# EAGLE schematic FanController (EAGLE 9.6.2)
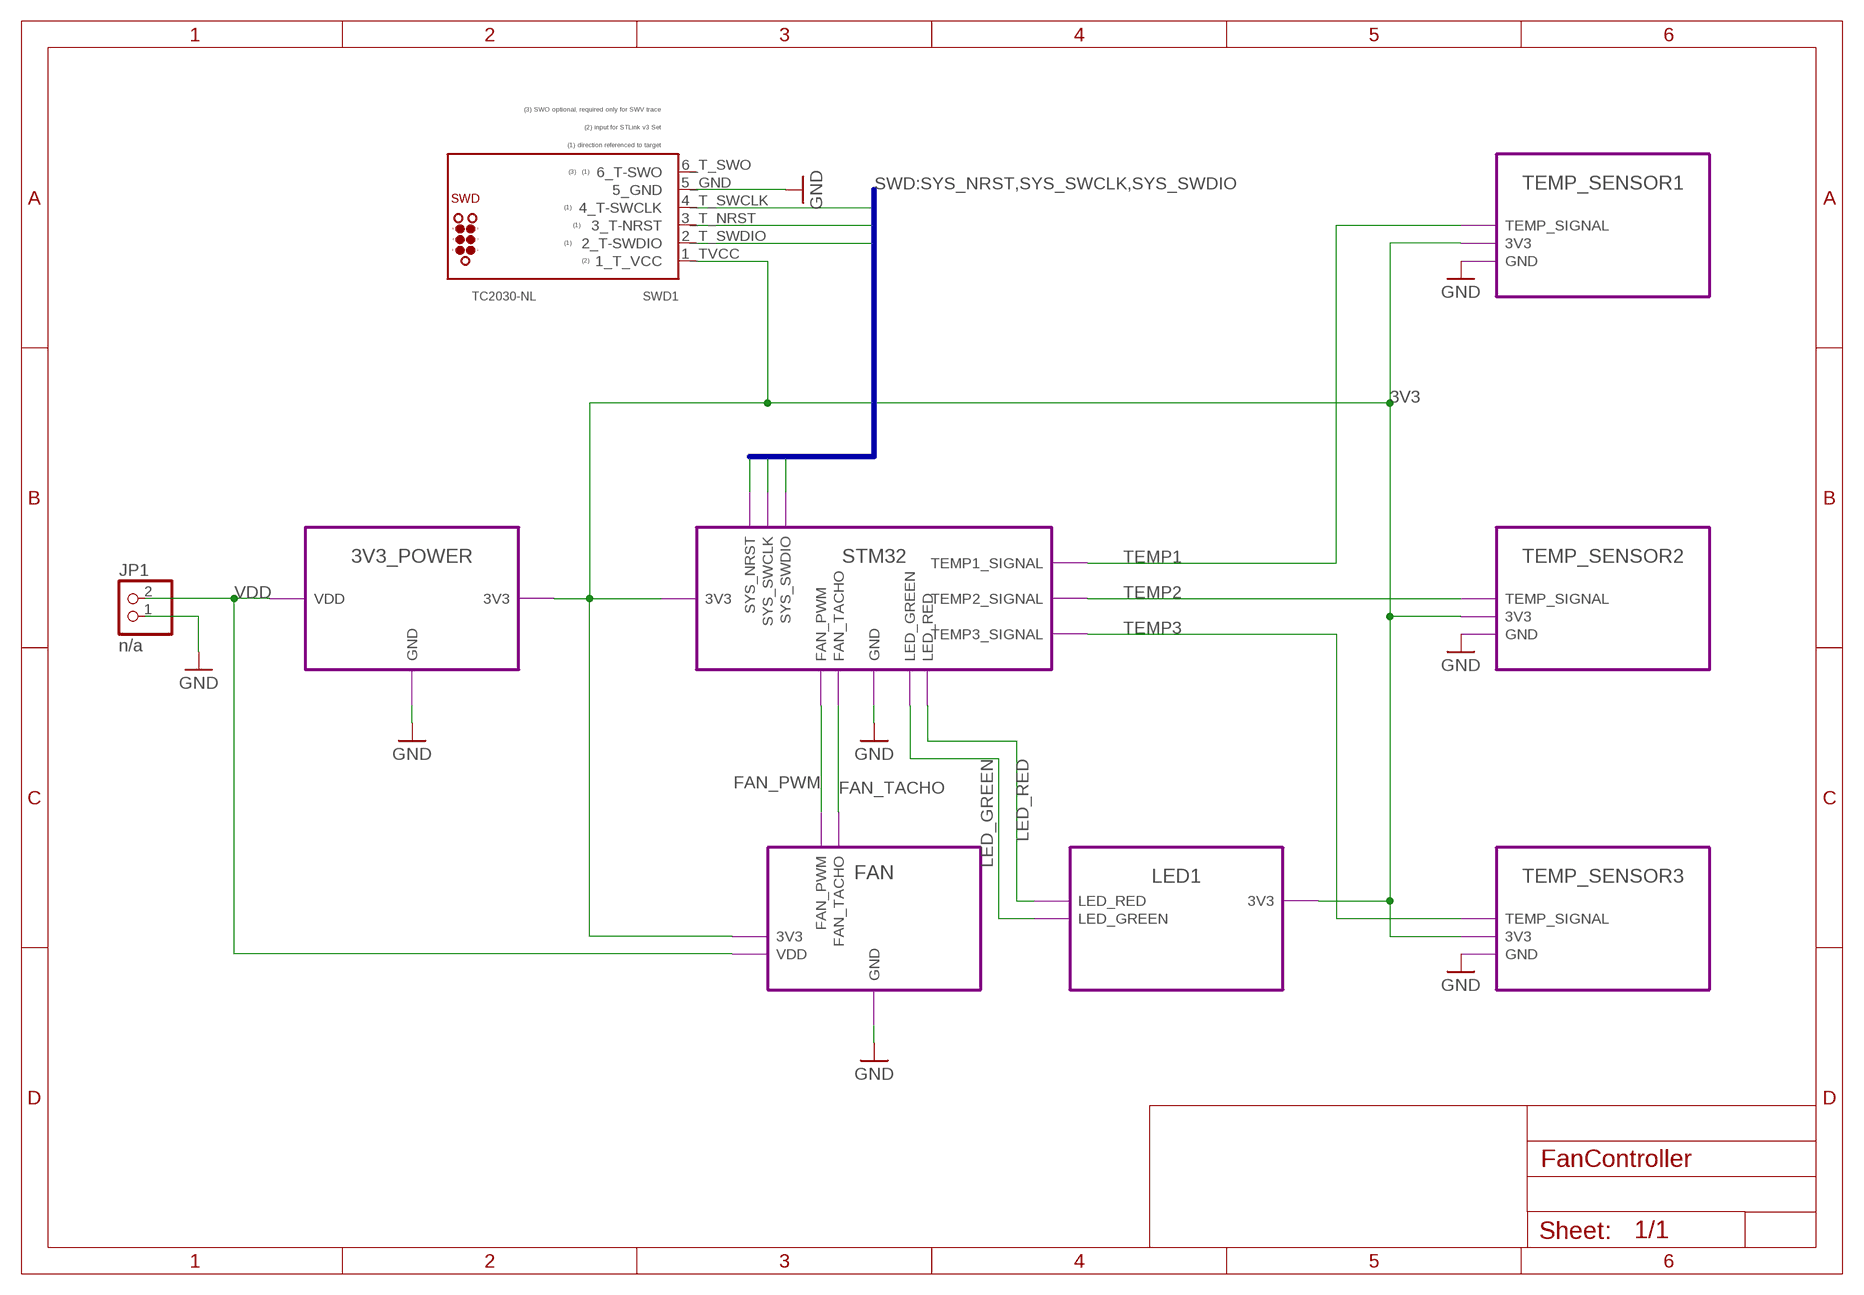
[diagram p0: schematic, sheet 1]

## Parts
JP1  n/a  PINHD-1X2  [1X02]
SWD1  TC2030-NL  TC2030  [TC2030-NL]

## Module instances
3V3_POWER = 3V3_POWER (part numbers offset by 100)
STM32 = STM32 (part numbers offset by 200)
TEMP_SENSOR1 = TEMP_SENSOR (part numbers offset by 400)
FAN = FAN (part numbers offset by 300)
TEMP_SENSOR2 = TEMP_SENSOR (part numbers offset by 500)
TEMP_SENSOR3 = TEMP_SENSOR (part numbers offset by 600)
LED1 = LED (part numbers offset by 700)

## Nets
3V3 [3V3]: SWD1.1_TVCC(1_T_VCC) ; port TEMP_SENSOR1.3V3 TEMP_SENSOR3.3V3 TEMP_SENSOR2.3V3 3V3_POWER.3V3 STM32.3V3 LED1.3V3 FAN.3V3
FAN_PWM [signal]: port STM32.FAN_PWM FAN.FAN_PWM
FAN_TACHO [signal]: port FAN.FAN_TACHO STM32.FAN_TACHO
GND: JP1.1 SWD1.5_GND ; port FAN.GND STM32.GND 3V3_POWER.GND TEMP_SENSOR1.GND TEMP_SENSOR2.GND TEMP_SENSOR3.GND
LED_GREEN: port STM32.LED_GREEN LED1.LED_GREEN
LED_RED: port STM32.LED_RED LED1.LED_RED
SYS_NRST [signal]: SWD1.3_T_NRST(3_T-NRST) ; port STM32.SYS_NRST
SYS_SWCLK [signal]: SWD1.4_T_SWCLK(4_T-SWCLK) ; port STM32.SYS_SWCLK
SYS_SWDIO [signal]: SWD1.2_T_SWDIO(2_T-SWDIO) ; port STM32.SYS_SWDIO
TEMP1 [signal]: port STM32.TEMP1_SIGNAL TEMP_SENSOR1.TEMP_SIGNAL
TEMP2 [signal]: port STM32.TEMP2_SIGNAL TEMP_SENSOR2.TEMP_SIGNAL
TEMP3 [signal]: port STM32.TEMP3_SIGNAL TEMP_SENSOR3.TEMP_SIGNAL
VDD [3V3]: JP1.2 ; port 3V3_POWER.VDD FAN.VDD
Unconnected: SWD1.6_T_SWO(6_T-SWO)

## Buses
SWD:SYS_NRST,SYS_SWCLK,SYS_SWDIO

## Library data of the parts
JP1 = pinhead:PINHD-1X2: PIN HEADER
SWD1 = tag-connect:TC2030: TC2030 pad no. Function STLink v3 CN1 pin no. Function 1 Reserved (1) 2 Reserved (1) 1 T_Vcc 3 T_Vcc (2) 2 T_SWDIO 4 T_JTMS/T_SWDIO 5 GND 4 T_SWCLK 6 T_JCLK / T_SWCLK 5 GND 7 GND 6 8 T_JTDO / T_SWO (3) 9 T_JRCLK (4) / NC (5) 10 T_JTDI / NC (5) 11 GNDDetect (6) 3 T_NRST 12 T_NRST 13 T_VCP_RX (7) 14 T_VCP_TX (2) (1) Do not connect to the target (2) Input for STLINK-V3SET (3) SWO is optional, required only for Serial Wire Viewer (SWV) trace (4) Optional loopback of T_JCLK on the target side, required if loopback is removed on the STLINK-V3SET side (5) NC means not required for the SWD connection (6) Tied to GND by STLINK-V3SET firmware; may be used by the target for detection of the tool (7) Output for STLINK-V3SET

## Module 3V3_POWER
Ports: GND(pwr) VDD(pwr) 3V3(pwr)
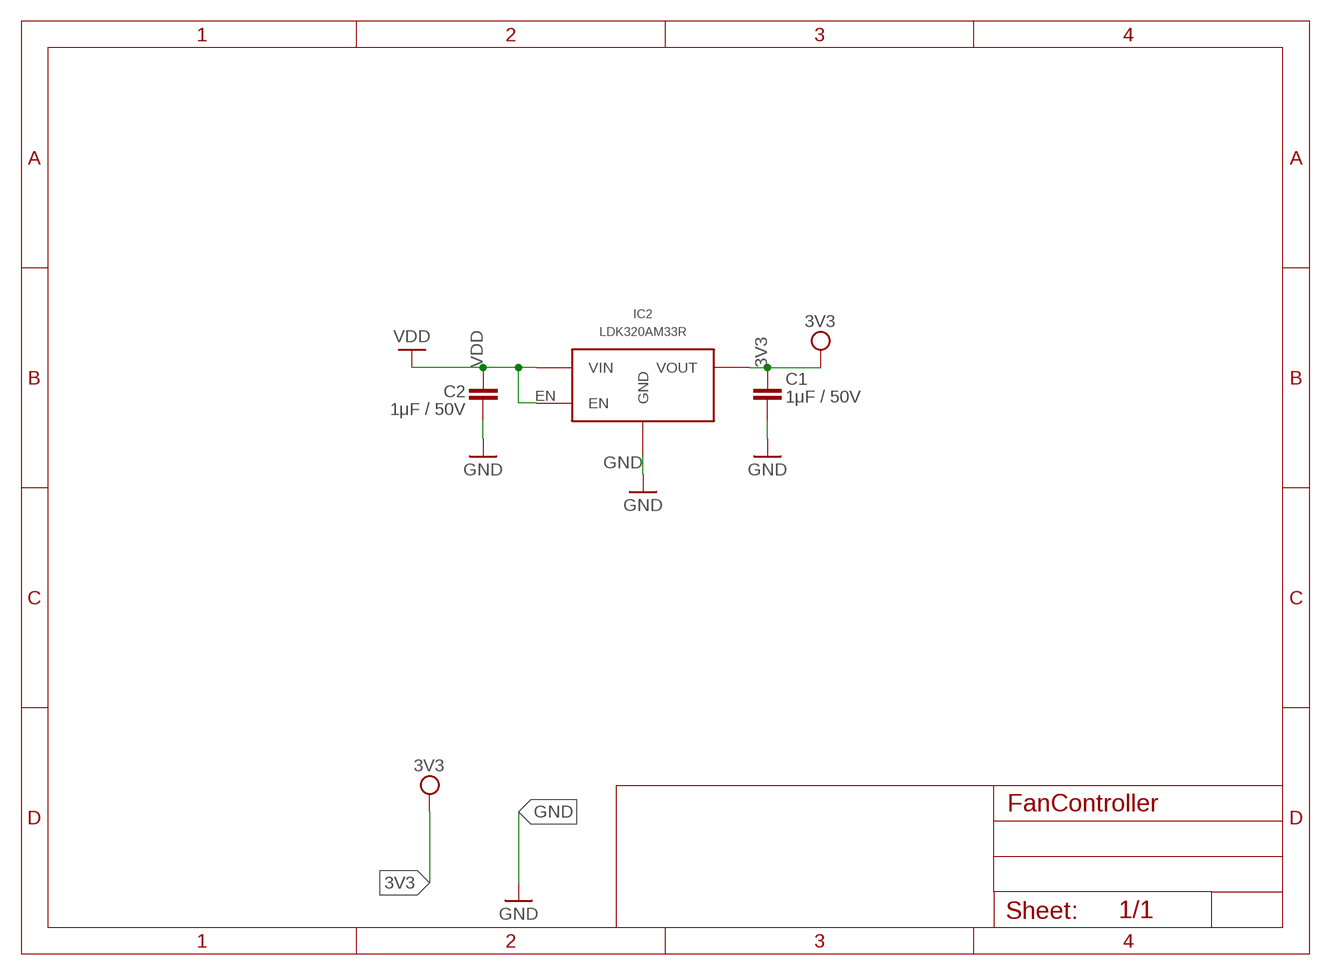
[diagram p1: schematic, module 3V3_POWER, sheet 1]

### Parts
C1  1μF / 50V  C-EUC0805  [C0805]
C2  1μF / 50V  C-EUC0805  [C0805]
IC2  LDK320AM33R  LDK320SOT-23-5L  [SOT-23-5L]

### Nets
3V3: C1.1 IC2.OUT(VOUT)
GND: C1.2 C2.2 IC2.GND
VDD: C2.1 IC2.EN IC2.IN(VIN)

### Library data of the parts
C1 C2 = rcl:C-EU: CAPACITOR, European symbol; SPICEPREFIX: C
IC2 = LDK320 5V LDO:LDK320

## Module STM32
Ports: GND(pwr) 3V3(pwr) FAN_PWM(out) TEMP1_SIGNAL(in) TEMP2_SIGNAL(in) TEMP3_SIGNAL(in) SYS_NRST(in) SYS_SWCLK(io) SYS_SWDIO(io) FAN_TACHO(in) LED_GREEN(in) LED_RED(in)
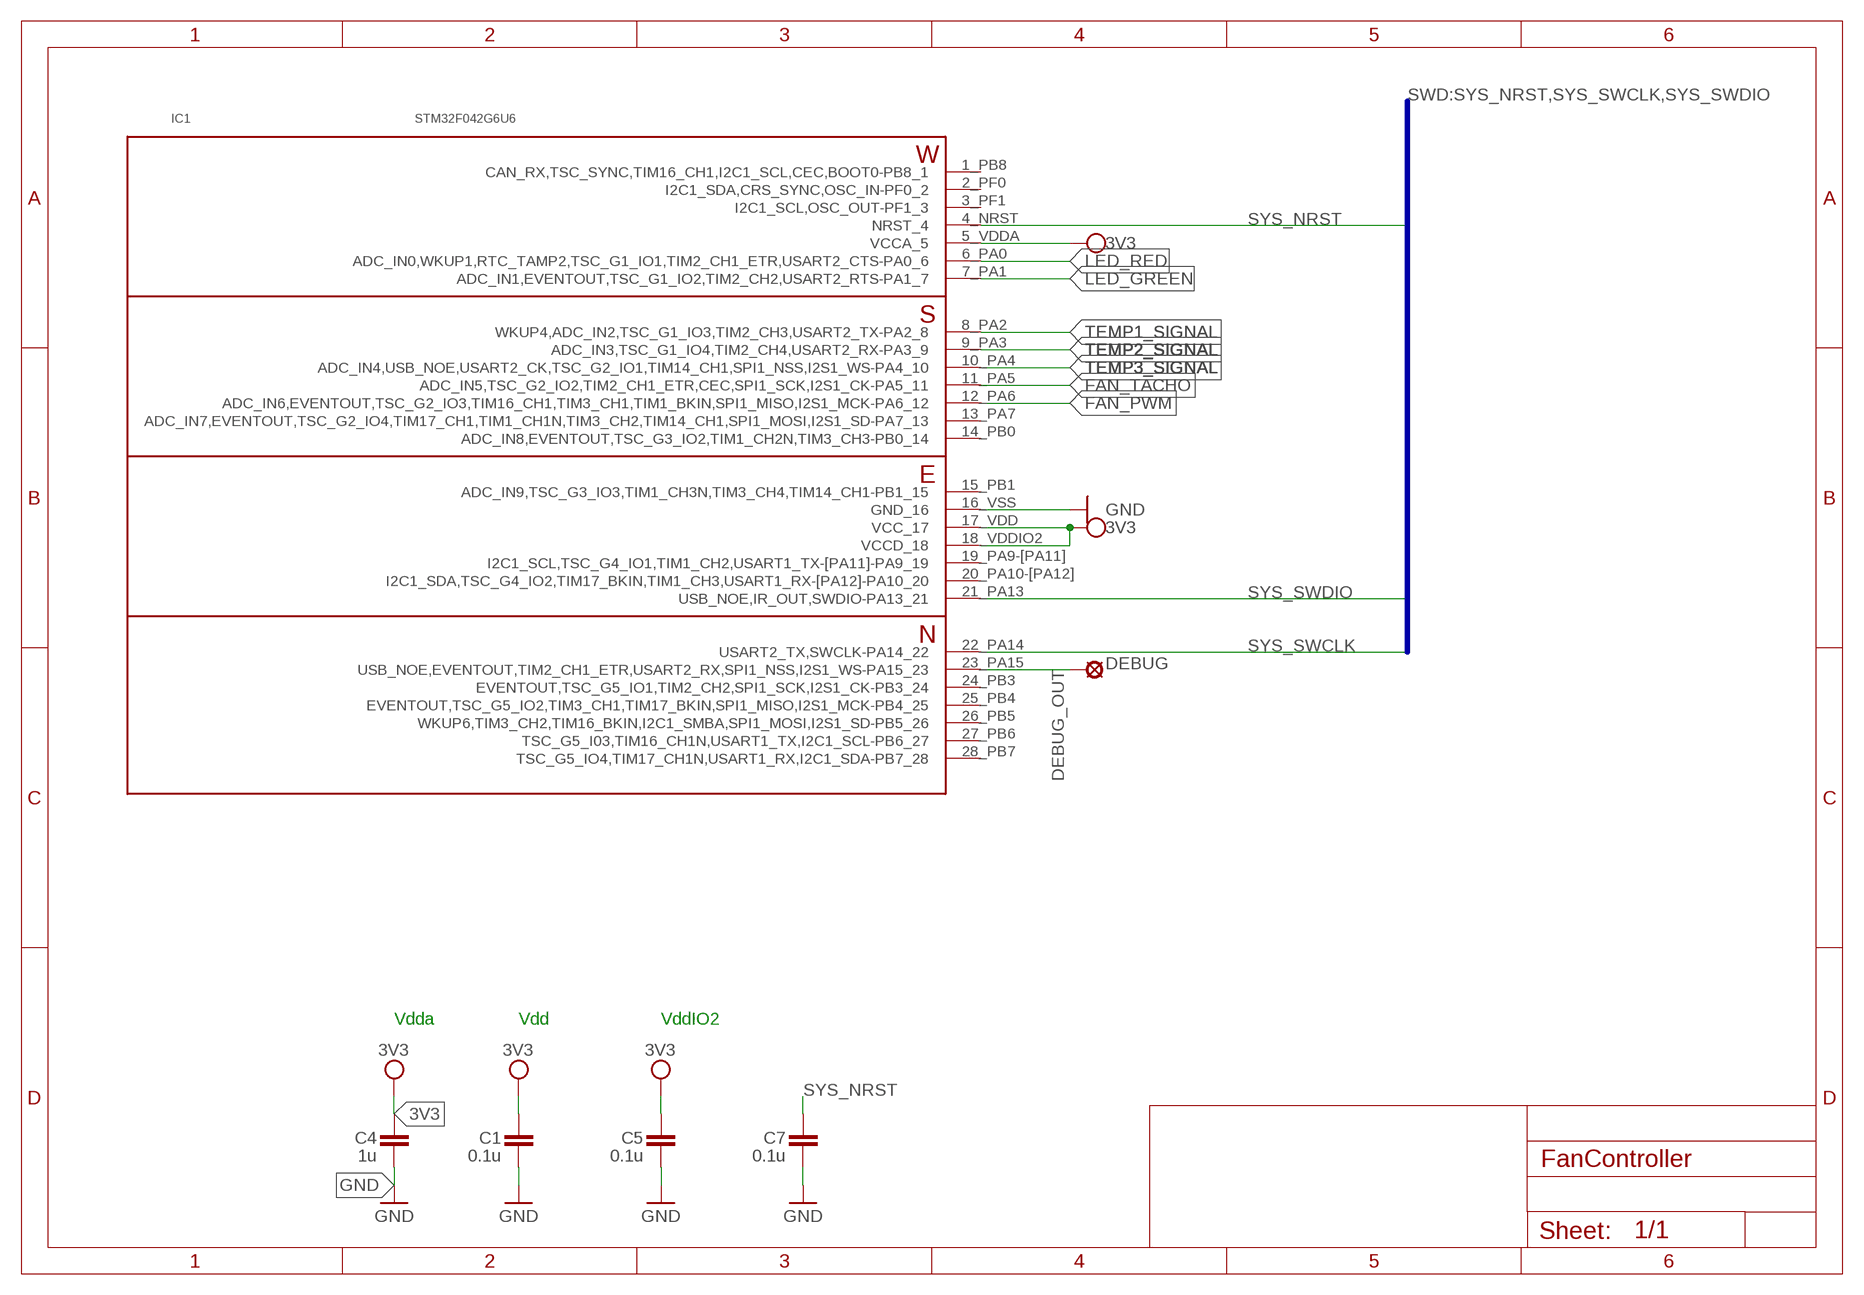
[diagram p2: schematic, module STM32, sheet 1]

### Parts
C1  0.1u  C-EUC0805  [C0805]
C4  1u  C-EUC0805  [C0805]
C5  0.1u  C-EUC0805  [C0805]
C7  0.1u  C-EUC0805  [C0805]
DEBUG  LSP10  [LSP10]
IC1  STM32F042G6U6  STM32F042G6  [UFQFPN-28]

### Nets
3V3: C1.2 C4.2 C5.2 IC1.5_VDDA(VCCA_5) IC1.17_VDD(VCC_17) IC1.18_VDDIO2(VCCD_18)
DEBUG_OUT: DEBUG.MP IC1.23_PA15(USB_NOE,EVENTOUT,TIM2_CH1_ETR,USART2_RX,SPI1_NSS,I2S1_WS-PA15_23)
FAN_PWM: IC1.12_PA6(ADC_IN6,EVENTOUT,TSC_G2_IO3,TIM16_CH1,TIM3_CH1,TIM1_BKIN,SPI1_MISO,I2S1_MCK-PA6_12)
FAN_TACHO: IC1.11_PA5(ADC_IN5,TSC_G2_IO2,TIM2_CH1_ETR,CEC,SPI1_SCK,I2S1_CK-PA5_11)
GND: C1.1 C4.1 C5.1 C7.1 IC1.16_VSS(GND_16)
LED_GREEN [3V3]: IC1.7_PA1(ADC_IN1,EVENTOUT,TSC_G1_IO2,TIM2_CH2,USART2_RTS-PA1_7)
LED_RED [3V3]: IC1.6_PA0(ADC_IN0,WKUP1,RTC_TAMP2,TSC_G1_IO1,TIM2_CH1_ETR,USART2_CTS-PA0_6)
SYS_NRST: C7.2 IC1.4_NRST(NRST_4)
SYS_SWCLK: IC1.22_PA14(USART2_TX,SWCLK-PA14_22)
SYS_SWDIO: IC1.21_PA13(USB_NOE,IR_OUT,SWDIO-PA13_21)
TEMP1_SIGNAL: IC1.8_PA2(WKUP4,ADC_IN2,TSC_G1_IO3,TIM2_CH3,USART2_TX-PA2_8)
TEMP2_SIGNAL: IC1.9_PA3(ADC_IN3,TSC_G1_IO4,TIM2_CH4,USART2_RX-PA3_9)
TEMP3_SIGNAL: IC1.10_PA4(ADC_IN4,USB_NOE,USART2_CK,TSC_G2_IO1,TIM14_CH1,SPI1_NSS,I2S1_WS-PA4_10)
Unconnected: IC1.1_PB8(CAN_RX,TSC_SYNC,TIM16_CH1,I2C1_SCL,CEC,BOOT0-PB8_1) IC1.2_PF0(I2C1_SDA,CRS_SYNC,OSC_IN-PF0_2) IC1.3_PF1(I2C1_SCL,OSC_OUT-PF1_3) IC1.13_PA7(ADC_IN7,EVENTOUT,TSC_G2_IO4,TIM17_CH1,TIM1_CH1N,TIM3_CH2,TIM14_CH1,SPI1_MOSI,I2S1_SD-PA7_13) IC1.14_PB0(ADC_IN8,EVENTOUT,TSC_G3_IO2,TIM1_CH2N,TIM3_CH3-PB0_14) IC1.15_PB1(ADC_IN9,TSC_G3_IO3,TIM1_CH3N,TIM3_CH4,TIM14_CH1-PB1_15) IC1.19_PA9-[PA11](I2C1_SCL,TSC_G4_IO1,TIM1_CH2,USART1_TX-[PA11]-PA9_19) IC1.20_PA10-[PA12](I2C1_SDA,TSC_G4_IO2,TIM17_BKIN,TIM1_CH3,USART1_RX-[PA12]-PA10_20) IC1.24_PB3(EVENTOUT,TSC_G5_IO1,TIM2_CH2,SPI1_SCK,I2S1_CK-PB3_24) IC1.25_PB4(EVENTOUT,TSC_G5_IO2,TIM3_CH1,TIM17_BKIN,SPI1_MISO,I2S1_MCK-PB4_25) IC1.26_PB5(WKUP6,TIM3_CH2,TIM16_BKIN,I2C1_SMBA,SPI1_MOSI,I2S1_SD-PB5_26) IC1.27_PB6(TSC_G5_I03,TIM16_CH1N,USART1_TX,I2C1_SCL-PB6_27) IC1.28_PB7(TSC_G5_IO4,TIM17_CH1N,USART1_RX,I2C1_SDA-PB7_28)

### Buses
SWD:SYS_NRST,SYS_SWCLK,SYS_SWDIO

### Notes on the sheet
- Vdda | Vdd | VddIO2

### Library data of the parts
C1 C4 C5 C7 = rcl:C-EU: CAPACITOR, European symbol; SPICEPREFIX: C
DEBUG = solpad:LSP10: SOLDER PAD drill 1.0 mm, distributor Buerklin, 12H555
IC1 = STM32F042G6:STM32F042G6

## Module TEMP_SENSOR
Ports: GND(pwr) 3V3(pwr) TEMP_SIGNAL(out)
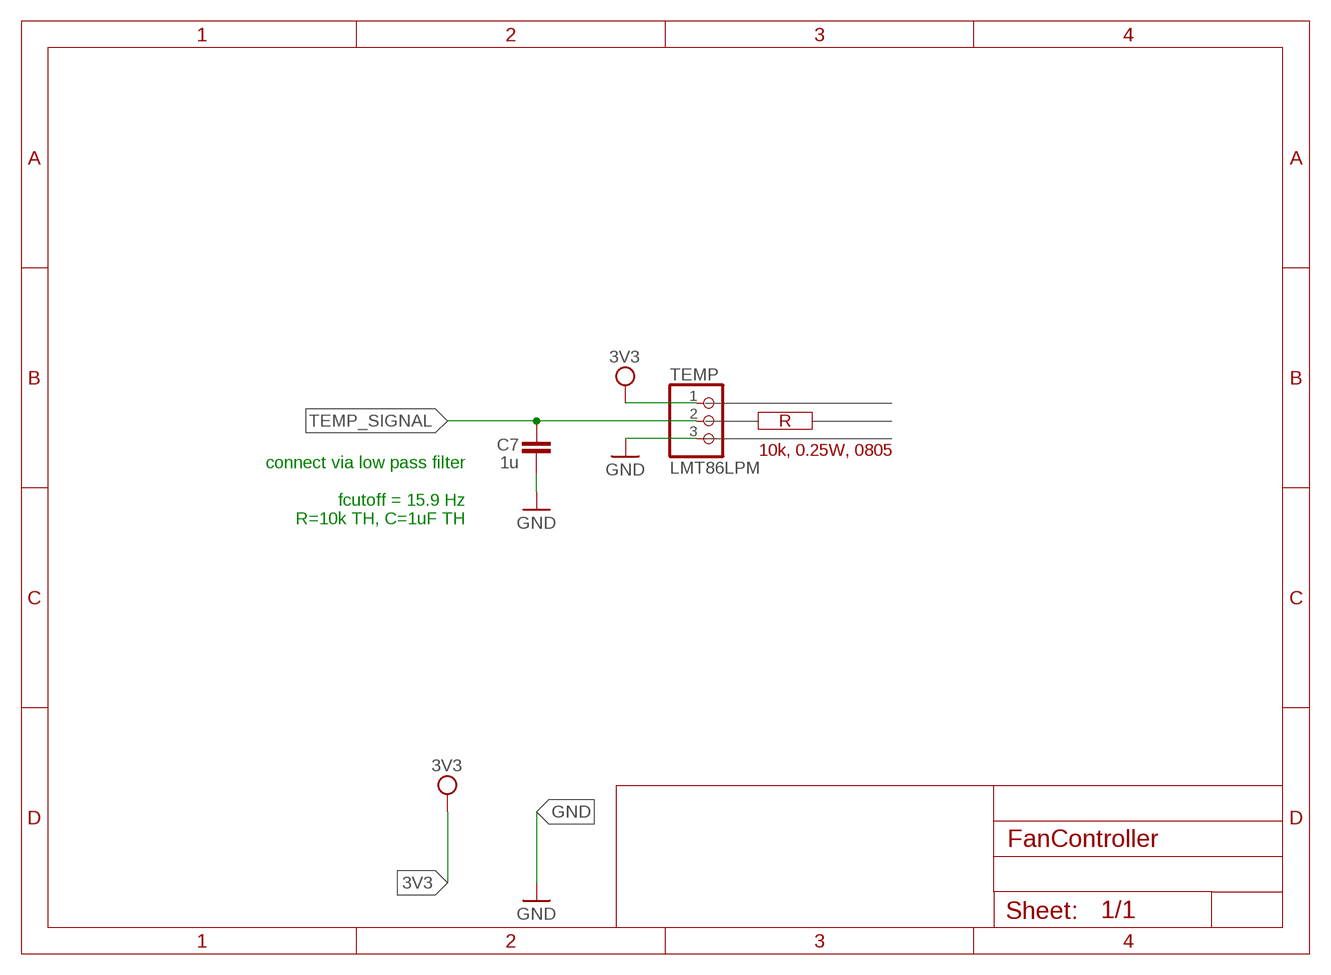
[diagram p3: schematic, module TEMP_SENSOR, sheet 1]

### Parts
C7  1u  C-EUC0805  [C0805]
TEMP  LMT86LPM  PINHD-1X3  [1X03]

### Nets
3V3: TEMP.1
GND: C7.1 TEMP.3
TEMP_SIGNAL: C7.2 TEMP.2

### Notes on the sheet
- R
- connect via low pass filter
  
  fcutoff = 15.9 Hz
  R=10k TH, C=1uF TH
- 10k, 0.25W, 0805

### Library data of the parts
C7 = rcl:C-EU: CAPACITOR, European symbol; SPICEPREFIX: C
TEMP = pinhead:PINHD-1X3: PIN HEADER

## Module FAN
Ports: GND(pwr) FAN_PWM(in) VDD(pwr) FAN_TACHO(out) 3V3(pwr)
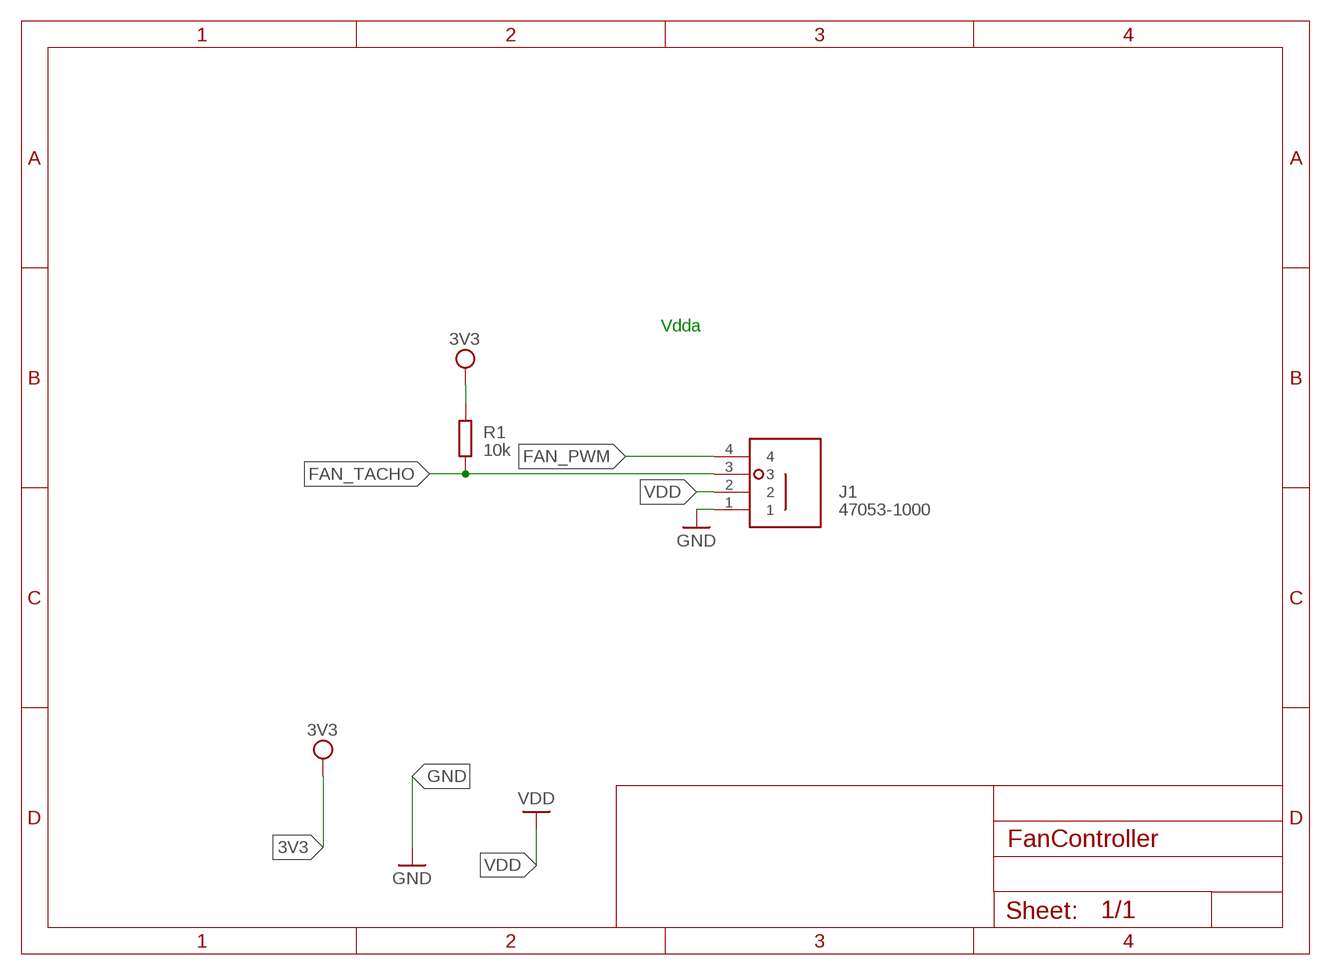
[diagram p4: schematic, module FAN, sheet 1]

### Parts
J1  47053-1000  [470531000]
R1  10k  R-EU_R0805  [R0805]

### Nets
3V3: R1.2
FAN_PWM: J1.4
FAN_TACHO: J1.3 R1.1
GND: J1.1
VDD: J1.2

### Notes on the sheet
- Vdda

### Library data of the parts
J1 = 47053-1000:47053-1000: MOLEX - 47053-1000 - HEADER, 4POS, 1ROW, 2.54MM Source: Datasheet <http://www.molex.com/pdm_docs/sd/470531000_sd.pdf> Check availability <https://pricing.snapeda.com/parts/47053-1000/Molex/view-part?ref=eda>; AVAILABILITY: In Stock; CHECK_PRICES: https://www.snapeda.com/parts/47053-1000/Molex/view-part/?ref=eda; DESCRIPTION: Conn.; Rect./PCB; Header; 4 Cir.; Vert.; with Friction Lock; KK 254 Series | Molex Incorporated 47053-1000; MF: Molex; MP: 47053-1000; PACKAGE: None; PRICE: None; SNAPEDA_LINK: https://www.snapeda.com/parts/47053-1000/Molex/view-part/?ref=snap
R1 = rcl:R-EU_: RESISTOR, European symbol; SPICEPREFIX: R

## Module LED
Ports: LED_GREEN(out) LED_RED(out) 3V3(pwr)
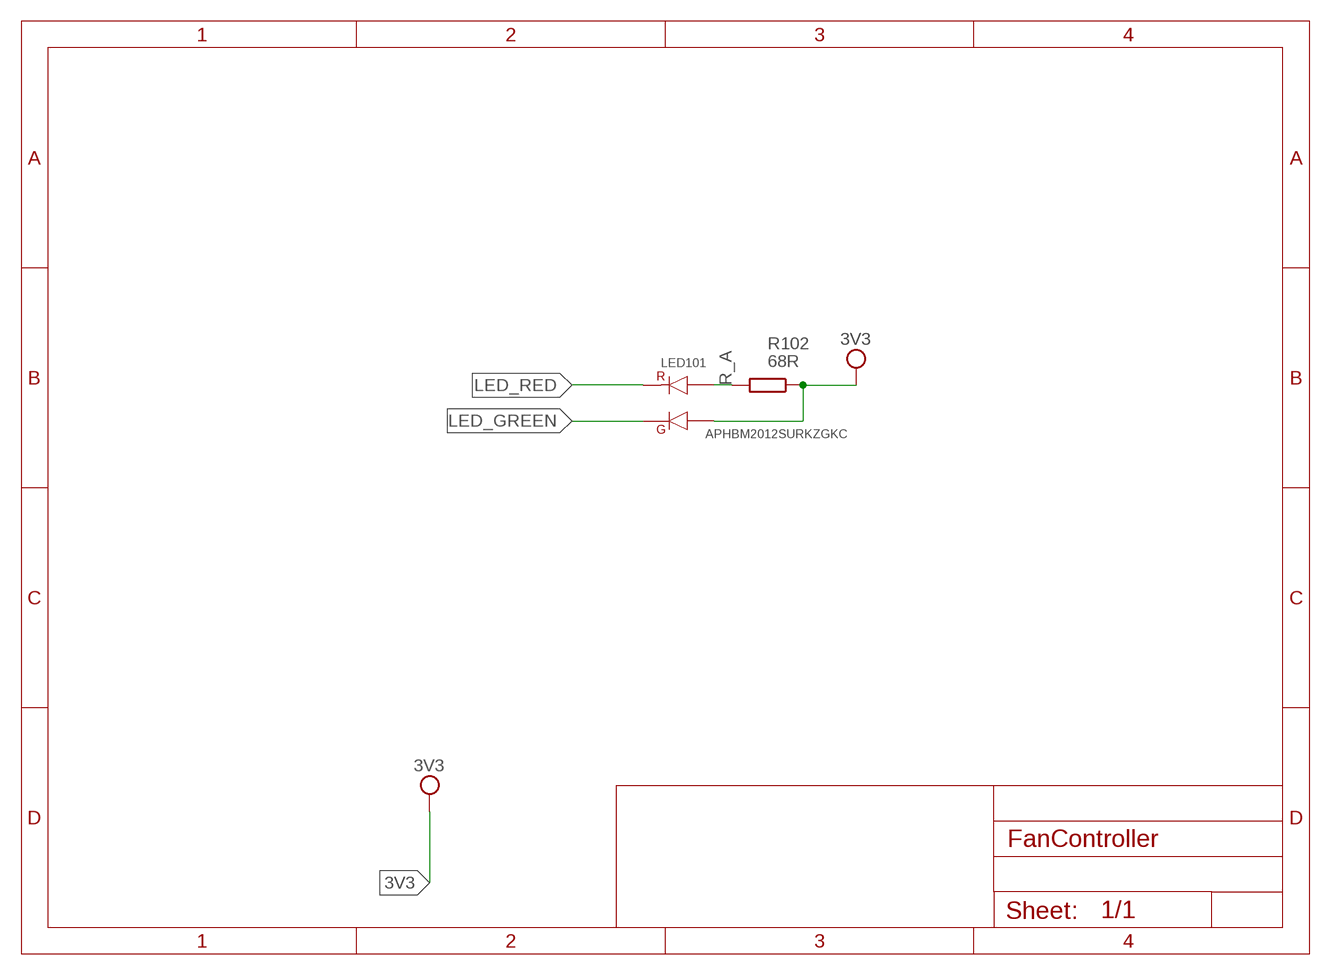
[diagram p5: schematic, module LED, sheet 1]

### Parts
LED101  APHBM2012SURKZGKC  APHBM2012LSURKZGKC  [SMD]
R102  68R  R-EU_R0805  [R0805]

### Nets
3V3 [3V3]: LED101.4 R102.1
LED_GREEN [signal]: LED101.3
LED_RED [signal]: LED101.2
R_A [signal]: LED101.1 R102.2

### Library data of the parts
LED101 = APHBM2012LSURKZGKC:APHBM2012LSURKZGKC
R102 = rcl:R-EU_: RESISTOR, European symbol; SPICEPREFIX: R

## Net classes
0 GND: width 0.25 mm, drill 0.35 mm, clearance 0.19 mm
1 signal: width 0.25 mm, drill 0.35 mm, clearance 0.2 mm to class 0
4 3V3: width 0.25 mm, drill 0.35 mm, clearance 0.2 mm to class 0, clearance 0.2 mm to class 1, clearance 0.19 mm